# Altium project Speed_Detect.PrjPcb
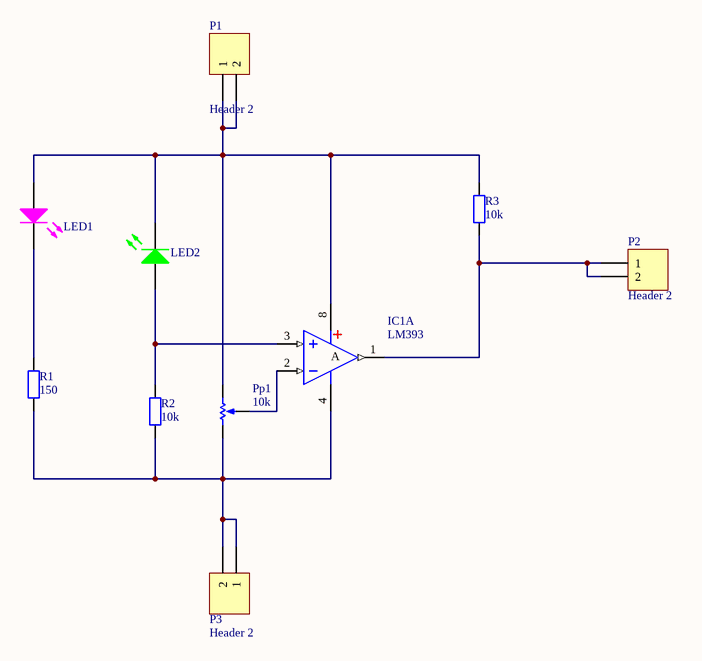
[diagram p0: Sheet1.SchDoc]
1 sheet, 10 parts. Net scope: global (net labels, ports and power ports of the same name join across sheets).
Board file: PCB1.PcbDoc

## Sheet Sheet1.SchDoc
size A4

### Parts
IC1  LM393  [DIP8-300]  (part A of 2)
LED1  LED-3-R  [LED-R3-H5-SINGLE-R]  (value not drawn)
LED2  LED-3-G  [LED-R3-H5-SINGLE-G]  (value not drawn)
P1  Header 2  [HDR1X2]
P2  Header 2  [HDR1X2]
P3  Header 2  [HDR1X2]
Pp1  10k  [RP_3296]
R1  value 150  [AXIAL-0.3]  (hidden comment: Resistor)
R2  value 10k  [AXIAL-0.3]  (hidden comment: Resistor)
R3  value 10k  [AXIAL-0.3]  (hidden comment: Resistor)

### Nets
NetIC1_1: IC1.1(OUT) P2.1 P2.2 R3.1
NetIC1_2: IC1.2(IN-) Pp1.2(TAP)
NetIC1_3: IC1.3(IN+) LED2.1(A) R2.2
NetIC1_4: IC1.4(V-) P3.1 P3.2 Pp1.1(TOP) R1.1 R2.1
NetIC1_8: IC1.8(V+) LED1.1(A) LED2.2(K) P1.1 P1.2 Pp1.3(BOT) R3.2
NetLED1_2: LED1.2(K) R1.2

### Notes on the sheet
- (in symbol LM393, part A) A

### Library data of the parts
IC1 = LM393: 双路电压比较; 版权归属: 源创客; BOM名称: 双路电压比较; 学习资源: www.ooocke.com
LED1 = LED-3-R: Typical INFRARED GaAs LED; Published: 8-Jun-2000; Revision: July-2002: Re-released for DXP Platform.; Publisher: Altium Limited
LED2 = LED-3-G: Typical INFRARED GaAs LED; Published: 8-Jun-2000; Revision: July-2002: Re-released for DXP Platform.; Publisher: Altium Limited
P1-P3 = Header 2: Header, 2-Pin; LatestRevisionDate: 17-Jul-2002; LatestRevisionNote: Re-released for DXP Platform.; Publisher: Altium Limited
Pp1 = RP_3296: 3296电位器; 购买链接: https://item.taobao.com/item.htm?spm=a230r.1.14.90.21641e34zQj3ul&id=19303265869&ns=1&abbucket=13#detail
R1-R3 = Resistor: Published: 8-Jun-2000; Revision: July-2002: Re-released for DXP Platform.; Publisher: Altium Limited